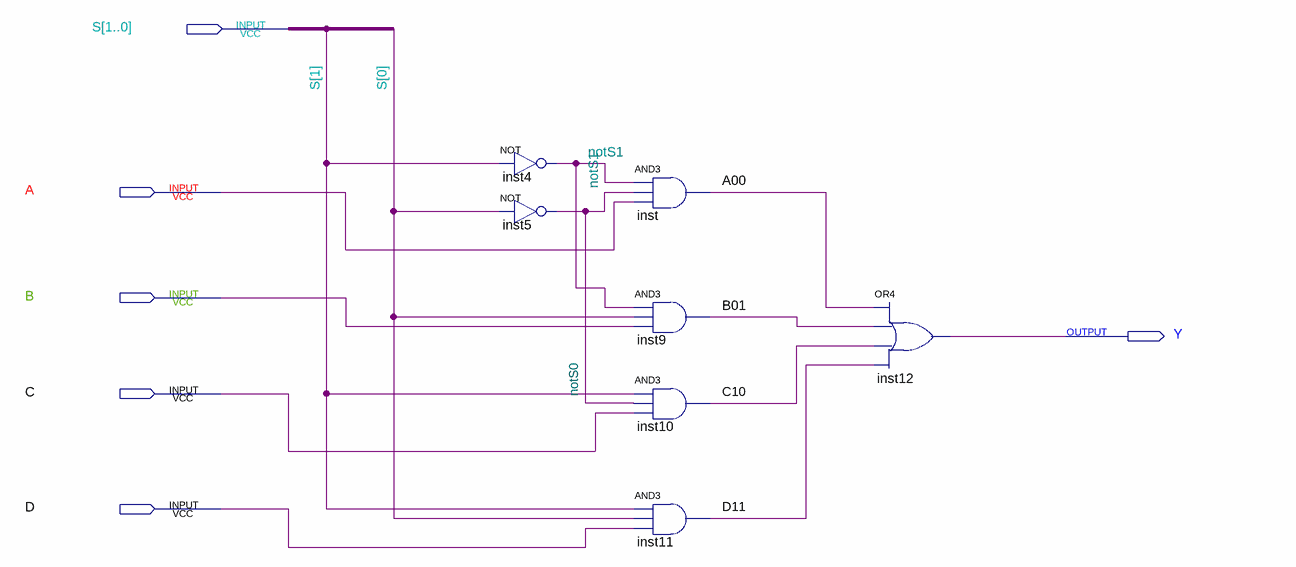
[diagram p0: schematic sheet]
// Quartus schematic MUX4.bdf as structural Verilog: 7 symbols, 6 pins
module MUX4 (
  input  [1:0] S,
  input  A,
  input  B,
  input  C,
  input  D,
  output Y
);

  wire A00, B01, C10, D11, notS0, notS1;

  not inst4 (notS1, S[1]);
  not inst5 (notS0, S[0]);
  and inst (A00, notS1, notS0, A);
  and inst9 (B01, notS1, S[0], B);
  and inst10 (C10, S[1], notS0, C);
  and inst11 (D11, S[1], S[0], D);
  or inst12 (Y, A00, B01, C10, D11);
endmodule
